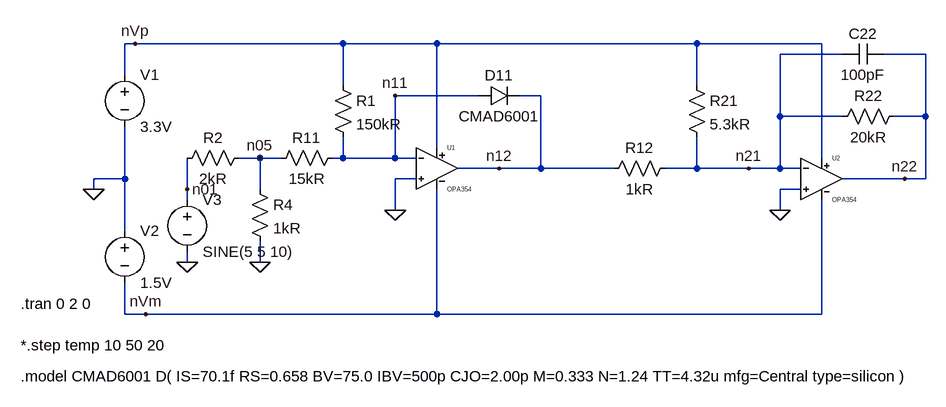
[diagram p0: schematic BiTuner_LogAmp.asc]
BiTuner_LogAmp.asc, the LTspice schematic file:
Version 4
SHEET 1 880 680
WIRE -640 -96 -656 -96
WIRE -320 -96 -640 -96
WIRE -176 -96 -320 -96
WIRE 224 -96 -176 -96
WIRE 416 -96 224 -96
WIRE 448 -80 352 -80
WIRE 576 -80 512 -80
WIRE -656 -48 -656 -96
WIRE -320 -32 -320 -96
WIRE 224 -32 224 -96
WIRE -112 -16 -240 -16
WIRE -16 -16 -48 -16
WIRE 352 16 352 -80
WIRE 448 16 352 16
WIRE 576 16 576 -80
WIRE 576 16 528 16
WIRE -176 64 -176 -96
WIRE -448 80 -480 80
WIRE -416 80 -448 80
WIRE -320 80 -320 48
WIRE -320 80 -336 80
WIRE -240 80 -240 -16
WIRE -240 80 -320 80
WIRE -208 80 -240 80
WIRE 416 80 416 -96
WIRE -80 96 -144 96
WIRE -16 96 -16 -16
WIRE -16 96 -80 96
WIRE 96 96 -16 96
WIRE 224 96 224 48
WIRE 224 96 176 96
WIRE 304 96 224 96
WIRE 352 96 352 16
WIRE 352 96 304 96
WIRE 384 96 352 96
WIRE -656 112 -656 32
WIRE -656 112 -704 112
WIRE -208 112 -240 112
WIRE 544 112 448 112
WIRE 576 112 576 16
WIRE 576 112 544 112
WIRE -704 128 -704 112
WIRE -560 128 -560 80
WIRE -448 128 -448 80
WIRE 384 128 352 128
WIRE -560 144 -560 128
WIRE -240 160 -240 112
WIRE 352 160 352 128
WIRE -656 192 -656 112
WIRE -560 240 -560 224
WIRE -448 240 -448 208
WIRE -656 320 -656 272
WIRE -624 320 -656 320
WIRE -176 320 -176 128
WIRE -176 320 -624 320
WIRE 416 320 416 144
WIRE 416 320 -176 320
FLAG -240 160 0
FLAG -704 128 0
FLAG -560 240 0
FLAG 352 160 0
FLAG -240 -16 n11
FLAG -80 96 n12
FLAG 304 96 n21
FLAG 544 112 n22
FLAG -640 -96 nVp
FLAG -624 320 nVm
FLAG -448 240 0
FLAG -448 80 n05
FLAG -560 128 n01
SYMBOL res -320 64 R90
WINDOW 0 0 56 VBottom 2
WINDOW 3 32 56 VTop 2
SYMATTR InstName R11
SYMATTR Value 15kR
SYMBOL diode -112 0 R270
WINDOW 0 32 32 VTop 2
WINDOW 3 0 32 VBottom 2
SYMATTR InstName D11
SYMATTR Value CMAD6001
SYMBOL voltage -656 -64 R0
WINDOW 123 0 0 Left 0
WINDOW 39 0 0 Left 0
SYMATTR InstName V1
SYMATTR Value 3.3V
SYMBOL voltage -656 176 R0
WINDOW 123 0 0 Left 0
WINDOW 39 0 0 Left 0
SYMATTR InstName V2
SYMATTR Value 1.5V
SYMBOL voltage -560 128 R0
WINDOW 123 0 0 Left 0
WINDOW 39 0 0 Left 0
SYMATTR InstName V3
SYMATTR Value SINE(5 5 10)
SYMBOL res 208 -48 R0
SYMATTR InstName R21
SYMATTR Value 5.3kR
SYMBOL res 544 0 R90
WINDOW 0 0 56 VBottom 2
WINDOW 3 32 56 VTop 2
SYMATTR InstName R22
SYMATTR Value 20kR
SYMBOL res 192 80 R90
WINDOW 0 0 56 VBottom 2
WINDOW 3 32 56 VTop 2
SYMATTR InstName R12
SYMATTR Value 1kR
SYMBOL cap 512 -96 R90
WINDOW 0 0 32 VBottom 2
WINDOW 3 32 32 VTop 2
SYMATTR InstName C22
SYMATTR Value 100pF
SYMBOL OPA354 -176 32 R0
SYMATTR InstName U1
SYMBOL OPA354 416 48 R0
SYMATTR InstName U2
SYMBOL res -336 -48 R0
SYMATTR InstName R1
SYMATTR Value 150kR
SYMBOL res -464 64 R90
WINDOW 0 0 56 VBottom 2
WINDOW 3 32 56 VTop 2
SYMATTR InstName R2
SYMATTR Value 2kR
SYMBOL res -464 112 R0
SYMATTR InstName R4
SYMATTR Value 1kR
TEXT -816 304 Left 2 !.tran 0 2 0
TEXT -816 368 Left 2 !*.step temp 10 50 20
TEXT -816 416 Left 2 !.model CMAD6001 D( IS=70.1f RS=0.658 BV=75.0 IBV=500p CJO=2.00p M=0.333 N=1.24 TT=4.32u mfg=Central type=silicon )

The netlist it stands for:
* BiTuner_LogAmp.asc
R11 n11 n05 15kR
D11 n11 n12 CMAD6001
V1 nVp 0 3.3V
V2 0 nVm 1.5V
V3 n01 0 SINE(5 5 10)
R21 nVp n21 5.3kR
R22 n22 n21 20kR
R12 n21 n12 1kR
C22 n22 n21 100pF
XU1 0 n11 nVp nVm n12 OPA354  ; pins In+ In- V+ V- OUT
XU2 0 n21 nVp nVm n22 OPA354  ; pins In+ In- V+ V- OUT
R1 nVp n11 150kR
R2 n05 n01 2kR
R4 n05 0 1kR
.model D D
.lib standard.dio
.tran 0 2 0
*.step temp 10 50 20
.model CMAD6001 D( IS=70.1f RS=0.658 BV=75.0 IBV=500p CJO=2.00p M=0.333 N=1.24 TT=4.32u mfg=Central type=silicon )
.lib OPA354.lib
.backanno
.end